# Altium schematic sheet speaker.SchDoc
size A; SheetNumber: 5; SheetTotal: 5
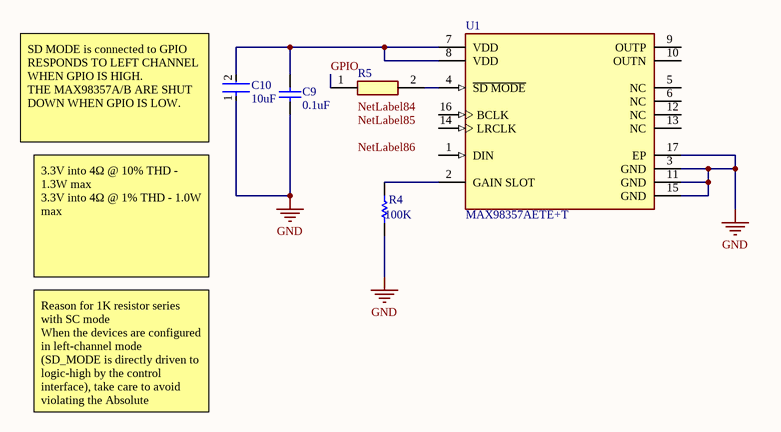
[diagram p0: speaker.SchDoc]

## Parts
C9  Capacitance: 0.1uF  [CAPC1050X55X23ML05T13]  (hidden comment: CL05B104KO5NNNC)
C10  Capacitance: 10uF  [FP-CL05A106MP5NUNC-MFG]  (hidden comment: CL05A106MP5NUNC)
R4  resistance: 100K  [RESC1005X40X25NL05T10]  (hidden comment: RC0402FR-07100KL)
R5  CR01005-FW-1001GLF  [CR01005FW1001GLF]  (value not drawn)
U1  MAX98357AETE+T  [FP-T1633-4-MFG]

## Nets
GND: C9.1 C10.1 R4.1 U1.3(GND) U1.11(GND) U1.15(GND) U1.17(EP)
GPIO: R5.1
NetC9_2: C9.2 C10.2 U1.7(VDD) U1.8(VDD)
NetR4_2: R4.2 U1.2(GAIN_SLOT)
NetR5_2: R5.2 U1.4(~{SD_MODE})

Not connected (* = marked no-connect by the designer): U1 1(DIN) 5(NC) 6(NC) 9(OUTP) 10(OUTN) 12(NC) 13(NC) 14(LRCLK) 16(BCLK)

## Notes on the sheet
- (near C10) SD MODE is connected to GPIO
  RESPONDS TO LEFT CHANNEL WHEN GPIO IS HIGH.
  THE MAX98357A/B ARE SHUT DOWN WHEN GPIO IS LOW.
- 3.3V into 4Ω @ 10% THD - 1.3W max
  3.3V into 4Ω @ 1% THD - 1.0W max
- Reason for 1K resistor series with SC mode
  When the devices are configured in left-channel mode
  (SD_MODE is directly driven to logic-high by the control interface), take care to avoid violating the Absolute
  Maximum Ratings limits for SD_MODE. Ensuring that
  VDD is always greater than VDDIO is one way to prevent
  SD_MODE from violating the Absolute Maximum Ratings
  limits. If this is not possible in the application (e.g., if VDD
  < 3.0V and VDDIO = 3.3V), then it is necessary to add a
  small resistance (~2kΩ) in series with SD_MODE to limit
  the current into the SD_MODE pin. This is not a concern
  when using the right channel or (left/2 + right/2) modes.
- Labels drawn without touching a wire or pin: NetLabel84, NetLabel85, NetLabel86

## Library data of the parts
C9 = CMP-2000-05439-1: Chip Capacitor, 100 nF, +/- 10%, 16 V, -55 to 125 degC, 0402 (1005 Metric), RoHS, Tape and Reel; Manufacturer: Samsung Electro-Mechanics; Dielectric: X7R; Rated Voltage: 16V; Case Size/Dimension: 0402; Tolerance (%): ±10%; Manufacturer URL: http://www.samsungsem.com/global/index.jsp; Datasheet URL: https://datasheet.ciiva.com/29198/458718-da-01-en-vs-kondensator-0402-29198423.pdf; Datasheet Version: Nov-10
C10 = CMP-13271-000002-1: CAP CER 10UF 10V X5R 0402; Manufacturer: Samsung; Temperature Coefficient: 15%; Tolerance: 20%; Material: Ceramic; Octopart: https://octopart.com/cl05a106mp5nunc-samsung-22457395; Voltage Rating: 10V; RoHS: TRUE; Value: 10uF; Height: 0.7mm; Digikey Description: CAP CER 10UF 10V X5R 0402; Automotive: No; Package: CL05A106MP5NUNC; Device Class L1: Passive Components; Temperature Range High: +85°C; ComponentLink2Description: Datasheet; Device Class L2: Capacitors; Temperature Characteristic: X5R; Manufacturer Part Number: CL05A106MP5NUNC; Temperature: -55°C to +85°C; ComponentLink2URL: http://www.samsungsem.com/kr/support/product-search/mlcc/__icsFiles/afieldfile/2019/05/10/19-CL05A106MP5NUNC.pdf; Device Class L3: Ceramic Capacitors; Category: Cap; Temperature Range Low: -55°C; Ipc Land Pattern Name: CAPC10050X50; Lead Free: Yes
R4 = CMP-2002-07343-1: Manufacturer: Yageo / Phycomp; Part Number: RC0402FR-07100KL
R5 = CR01005-FW-1001GLF: Resistor; Manufacturer_Name: Bourns; resistance: 1K; Datasheet Link: https://www.bourns.com/docs/product-datasheets/CRxxxxx.pdf; Height: 0.15mm; Manufacturer_Part_Number: CR01005-FW-1001GLF; Mouser Part Number: 576-CR01005-W1001GL; Mouser Price/Stock: https://www.mouser.co.uk/ProductDetail/Bourns/CR01005-FW-1001GLF?qs=vmHwEFxEFR%252BLRqrp0ZxAlg%3D%3D
U1 = CMP-05698-000018-1: IC AMP CLASS D MONO 3.2W 16TQFN; Max Supply Voltage: 5.5V; Max Output Current: 1.6A; Voltage Gain: 15dB; Max Power Dissipation: 1.666W; Min Supply Voltage: 2.5V; Power Supply Rejection Ratio (PSRR): 77dB; Series: -; Contact Plating: Tin; Min Operating Temperature: -40°C; Packaging: Tape and Reel; Max Output Power: 3.2W; Mount: Surface Mount; Number of Pins: 16; RoHS Compliant: Yes; Max Operating Temperature: 85°C; Radiation Hardening: No